# Altium project P_A22_ControlBoard.PrjPcb
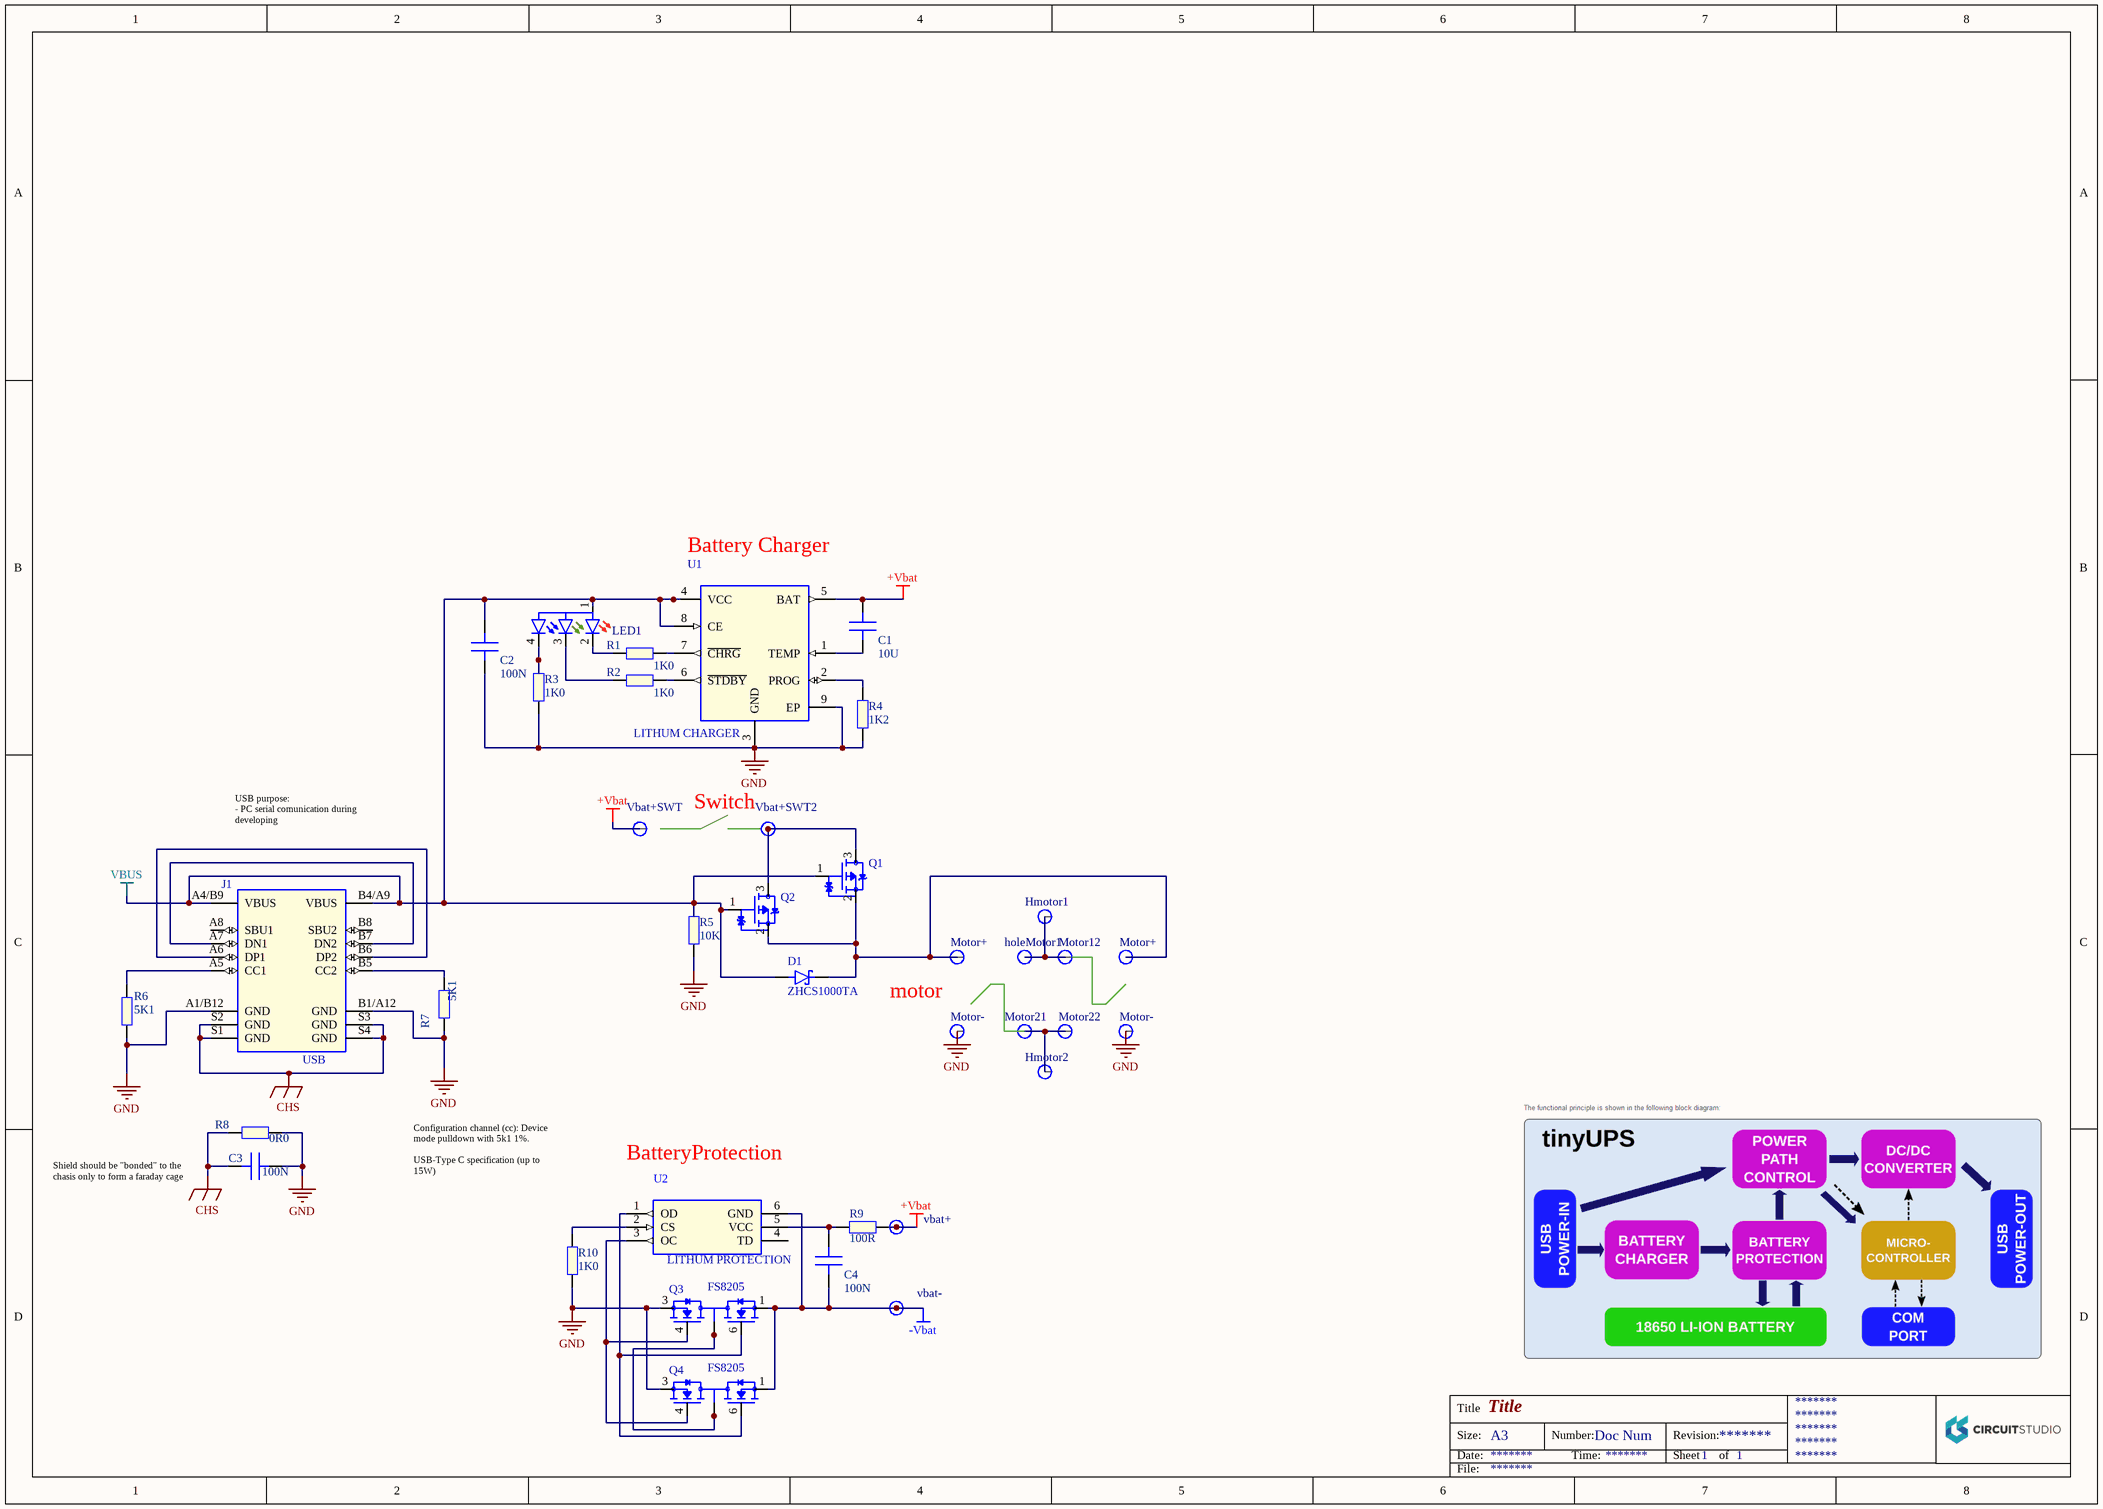
[diagram p0: CtlBoard.SchDoc]
1 sheet, 37 parts. Net scope: global (net labels, ports and power ports of the same name join across sheets).
Board file: CtlBoard_issueA.PcbDoc

## Sheet CtlBoard.SchDoc: Title
size A3; Date: *******; ApprovedBy: *******; CheckedBy: None; Author: *******; CompanyName: *******; DrawnBy: Name; Engineer: *******; Organization: *******; Address1: *******; Address2: *******; Address3: *******; Address4: *******; DocumentNumber: Doc Num; Revision: *******; SheetNumber: 1; SheetTotal: 1; CurrentTime: *******; CurrentDate: *******; Time: *******; DocumentFullPathAndName: *******; DocumentName: *******; ModifiedDate: *******; ImagePath: *******; ProjectName: *******; Application_BuildNumber: *******

### Parts
(Parts that share a designator on the sheet are numbered #1, #2 ... from top to bottom, then left to right.)
C1  10U  [CAPC2012X60N]
C2  100N  [CAPC2012X60N]
C3  100N  [CAPC2012X60N]
C4  100N  [CAPC2012X60N]
D1  ZHCS1000TA  [SOT95P230X110-3N]
Hmotor1  TESTPINT  [P200X100H90L100H50]  (value not drawn)
Hmotor2  TESTPINT  [P200X100H90L100H50]  (value not drawn)
holeMotor1  TESTPINT  [P200X100H90L100H50]  (value not drawn)
J1  USB  [GCT_USB4110-GF-A_REVB]
LED1  LED RGB  [LEDSC220X200X190-4]  (value not drawn)
Motor12  TESTPINT  [P200X100H90L100H50]  (value not drawn)
Motor21  TESTPINT  [P200X100H90L100H50]  (value not drawn)
Motor22  TESTPINT  [P200X100H90L100H50]  (value not drawn)
Motor+#1  TESTPINT  [P200X100H90L100H50]  (value not drawn)
Motor+#2  TESTPINT  [P200X100H90L100H50]  (value not drawn)
Motor-#1  TESTPINT  [P200X100H90L100H50]  (value not drawn)
Motor-#2  TESTPINT  [P200X100H90L100H50]  (value not drawn)
Q1  (no value)  [SOT91P240X110-3N]
Q2  (no value)  [SOT91P240X110-3N]
Q3  FS8205  [SOT95P280X145-6N]
Q4  FS8205  [SOT95P280X145-6N]
R1  1K0  [RESC2012X60N]
R2  1K0  [RESC2012X60N]
R3  1K0  [RESC2012X60N]
R4  1K2  [RESC2012X60N]
R5  10K  [RESC2012X60N]
R6  5K1  [RESC2012X60N]
R7  5K1  [RESC2012X60N]
R8  0R0  [RESC2012X60N]
R9  100R  [RESC2012X60N]
R10  1K0  [RESC2012X60N]
U1  LITHUM CHARGER  [SOP127P600X175-9N]
U2  LITHUM PROTECTION  [SOT95P280X145-6N]
vbat+  TESTPINT  [P200X100H90L100H50]  (value not drawn)
Vbat+SWT  TESTPINT  [P200X100H90L100H50]  (value not drawn)
Vbat+SWT2  TESTPINT  [P200X100H90L100H50]  (value not drawn)
vbat-  TESTPINT  [P200X100H90L100H50]  (value not drawn)

### Nets
+Vbat: C1.2 R9.1 U1.5(BAT) vbat+.1 Vbat+SWT.1
-Vbat: C4.1 Q3.1(S1) Q4.1(S1) U2.6(GND) vbat-.1
CHS: C3.1 J1.S1(GND) J1.S2(GND) J1.S3(GND) J1.S4(GND) R8.2
GND: C2.1 C3.2 J1.A1/B12(GND) J1.B1/A12(GND) Motor-#1.1 Motor-#2.1 Q3.3(S2) Q4.3(S2) R3.1 R4.1 R5.1 R6.1 R7.1 R8.1 R10.1 U1.3(GND) U1.9(EP)
VBUS: C2.2 D1.3(A) J1.A4/B9(VBUS) J1.B4/A9(VBUS) LED1.1(A) Q1.1(G) Q2.1(G) R5.2 U1.4(VCC) U1.8(CE)
NetC1_1: C1.1 U1.1(TEMP)
NetC4_2: C4.2 R9.2 U2.5(VCC)
NetD1_1: D1.1(K) Motor+#1.1 Motor+#2.1 Q1.2(S) Q2.2(S)
NetHmotor1_1: Hmotor1.1 holeMotor1.1 Motor12.1
NetHmotor2_1: Hmotor2.1 Motor21.1 Motor22.1
NetJ1_A5: J1.A5(CC1) R6.2
NetJ1_A6: J1.A6(DP1) J1.B6(DP2)
NetJ1_A7: J1.A7(DN1) J1.B7(DN2)
NetJ1_B5: J1.B5(CC2) R7.2
NetLED1_2: LED1.2(CRED) R1.1
NetLED1_3: LED1.3(CGREEN) R2.1
NetLED1_4: LED1.4(CBLUE) R3.2
NetQ1_3: Q1.3(D) Q2.3(D) Vbat+SWT2.1
NetQ3_2: Q3.2(D12) Q3.5(D12) Q4.2(D12) Q4.5(D12)
NetQ3_4: Q3.4(G2) Q4.4(G2) U2.3(OC)
NetQ3_6: Q3.6(G1) Q4.6(G1) U2.1(OD)
NetR1_2: R1.2 U1.7(~{CHRG})
NetR2_2: R2.2 U1.6(~{STDBY})
NetR4_2: R4.2 U1.2(PROG)
NetR10_2: R10.2 U2.2(CS)

Not connected (* = marked no-connect by the designer): J1 A8(SBU1) B8(SBU2); U2 4(TD)

### Notes on the sheet
- Battery Charger
- USB purpose:
  - PC serial comunication during developing
- (near Vbat+SWT2) Switch
- motor
- Shield should be "bonded" to the chasis only to form a faraday cage
- Configuration channel (cc): Device mode pulldown with 5k1 1%.
  USB-Type C specification (up to 15W)
- BatteryProtection
- Title
- Size:
- Date:
- A3
- Number:
- Time:
- Revision:
- Sheet
- of
- File:

### Library data of the parts
C1 = 139: 10U 0805  X6S 35V SMD Ceramic capacitor; UA P/N: 16-0004; Unique ID: 139; LibraryVersion: v1; Value: 10U; Farnell: 3581774; My_PN: *; Mounting: SMT; Cost: 0.172; Category: [0000] Passive components; Subcategory: [0002] Capacitor
C2-C4 = 118: 100N 0805 X7R 5% 50V SMD Ceramic capacitor; UA P/N: 16-0001; Unique ID: 118; LibraryVersion: v1; Value: 100N; Farnell: 2408561; My_PN: *; Mounting: SMT; Cost: 0.0195; Category: [0000] Passive components; Subcategory: [0002] Capacitor
D1 = 219: ZHCS1000TA Schottky Rectifier, 40V 1A 425 mV; UA P/N: 15-0119; Unique ID: 219; LibraryVersion: v1; Farnell: 9526773; Value: ZHCS1000TA; ComponentLink1Description: Web MF; ComponentLink1URL: https://www.diodes.com; ComponentLink2Description: Datasheet web; ComponentLink2URL: https://pdf1.alldatasheet.com/datasheet-pdf/view/515456/DIODES/ZHCS1000TA.html; ComponentLink3Description: Datasheet local; ComponentLink3URL: /D/; Cost: 0.157; Category: [0300] Discrete Semiconductors; Subcategory: [0308] Schottky Diodes; Mounting: SMT
Hmotor1 Hmotor2 holeMotor1 Motor12 Motor21 Motor22 Motor+#1 Motor+#2 Motor-#1 Motor-#2 vbat+ Vbat+SWT Vbat+SWT2 vbat- = 509: Unique ID: 509; Value: TESTPINT; Farnell: P50-H-120-G; Category: [0500] Connectors; Subcategory: [0510] Test pins
J1 = 399: USB C CONNECTOR SMD; UA P/N: 112-0099; Unique ID: 399; LibraryVersion: V1; Value: USB; Farnell: 3588206; ComponentLink1Description: Web MF; ComponentLink1URL: https://gct.co; ComponentLink2Description: Datasheet web; ComponentLink2URL: https://pdf1.alldatasheet.com/datasheet-pdf/view/1355856/ETC/USB4110-GF-A.html; ComponentLink3Description: Datasheet local; ComponentLink3URL: /D/; Cost: 0.662; Category: [0500] Connectors; Subcategory: [0502] USB connectors; Mounting: SMD
LED1 = 557: ASMB-KTF0-0A306; Unique ID: 557; LibraryVersion: v1; Availability: Unavailable; Price: None; Value: LED RGB; SnapEDA_Link: https://www.snapeda.com/parts/ASMB-KTF0-0A306/Broadcom%20Limited/view-part/2703546/?ref=snap; Cost: 0; Category: [0400] Optoelectronics; Subcategory: [0401] LEDs; Mounting: SMT
Q1 Q2 = 527: MOSFET; Unique ID: 527; LibraryVersion: V1; ComponentLink1Description: Web MF; ComponentLink1URL: https://www.diodes.com; ComponentLink2Description: Datasheet web; ComponentLink2URL: https://html.alldatasheet.com/html-pdf/833068/DIODES/DMP1045U/217/1/DMP1045U.html; ComponentLink3Description: Datasheet local; ComponentLink3URL: /D/; Cost: 0; Category: [0300] Discrete Semiconductors; Subcategory: [0303] MOSFETs; Mounting: SMT
Q3 Q4 = FS8205_1: Dual N-Channel Enhancement Mode Power MOSFET; MP: FS8205A; UA P/N: 15-0xxx; Farnell: *; Mouser: *; RS: *; DigiKey: *; Arrow: *; Profusion: *; My_P/N: *; HelpURL: http://forsemi.com; Package: SOT95P280X145-6N; Value: FS8205; ComponentLink1Description: Web MF; ComponentLink1URL: http://forsemi.com; ComponentLink2Description: Datasheet web; ComponentLink2URL: https://pdf1.alldatasheet.com/datasheet-pdf/view/1132762/FORTUNE/FS8205A.html; ComponentLink3Description: Datasheet local; ComponentLink3URL: /D/; Mounting: SMT
R1-R3 R10 = 21: 1K0 0805 Thick Film 1% Resistor; UA P/N: 13-0022; Unique ID: 21; LibraryVersion: v1; Value: 1K0; Farnell: 2446904; Mounting: SMT; My_PN: *; Cost: 0.00214; Category: [0000] Passive components; Subcategory: [0001] Resistor
R4 = 23: 1K2 0805 Thick Film 1% Resistor; UA P/N: 13-0024; Unique ID: 23; LibraryVersion: v1; Value: 1K2; Farnell: 2446906; Mounting: SMT; My_PN: *; Cost: 0.00352; Category: [0000] Passive components; Subcategory: [0001] Resistor
R5 = 6: 10K 0805Thick Film 1% Resistor; UA P/N: 13-0007; Unique ID: 6; LibraryVersion: v1; Value: 10K; Farnell: 2446870; Mounting: SMT; My_PN: *; Cost: 0.0014; Category: [0000] Passive components; Subcategory: [0001] Resistor
R6 R7 = 109: 5K1  0805 Thick Film 1% Resistor; UA P/N: 13-0111; Unique ID: 109; LibraryVersion: v1; Value: 5K1; Farnell: 2447009; My_PN: *; Mounting: SMT; Cost: 0.00176; Category: [0000] Passive components; Subcategory: [0001] Resistor
R8 = 0: 0R0 0805Thick Film 1% Resistor; UA P/N: 13-0001; Unique ID: 0; LibraryVersion: v1; Value: 0R0; Farnell: 2692652; My_PN: *; Mounting: SMT; Cost: 0.0049; Category: [0000] Passive components; Subcategory: [0001] Resistor
R9 = 3: 100R 0805Thick Film 1% resistor; UA P/N: 13-0004; Unique ID: 3; LibraryVersion: v1; Value: 100R; Farnell: 2446869; Mounting: SMT; My_PN: *; Cost: 0.00218; Category: [0000] Passive components; Subcategory: [0001] Resistor
U1 = 558: Unique ID: 558; LibraryVersion: v1; Value: LITHUM CHARGER; Footprint: *; Cost: 0; Category: [0100] Integrated circuits; Subcategory: [0117] Battery Management; Mounting: SMT
U2 = 559: Unique ID: 559; LibraryVersion: v1; Value: LITHUM PROTECTION; ComponentLink1Description: Web MF; ComponentLink1URL: https://hmsemi.com; ComponentLink2Description: Datasheet web; ComponentLink2URL: https://pdf1.alldatasheet.com/datasheet-pdf/view/1150541/HMSEMI/DW01A.html; ComponentLink3Description: Datasheet local; ComponentLink3URL: /D/; Cost: 0; Category: [0100] Integrated circuits; Subcategory: [0117] Battery Management; Mounting: SMT